# Altium schematic sheet Motor Driver_2.SchDoc
size A4; Organization: ORGANIZATION; Address1: ADDRESS 1; Address2: ADDRESS 2; Address3: ADDRESS 3; Address4: ADDRESS 4; Revision: -; SheetNumber: 9; SheetTotal: 11; ENG_APP_DATE: --/--/--; DSN_APP_DATE: --/--/--; CHK_APP_DATE: --/--/--
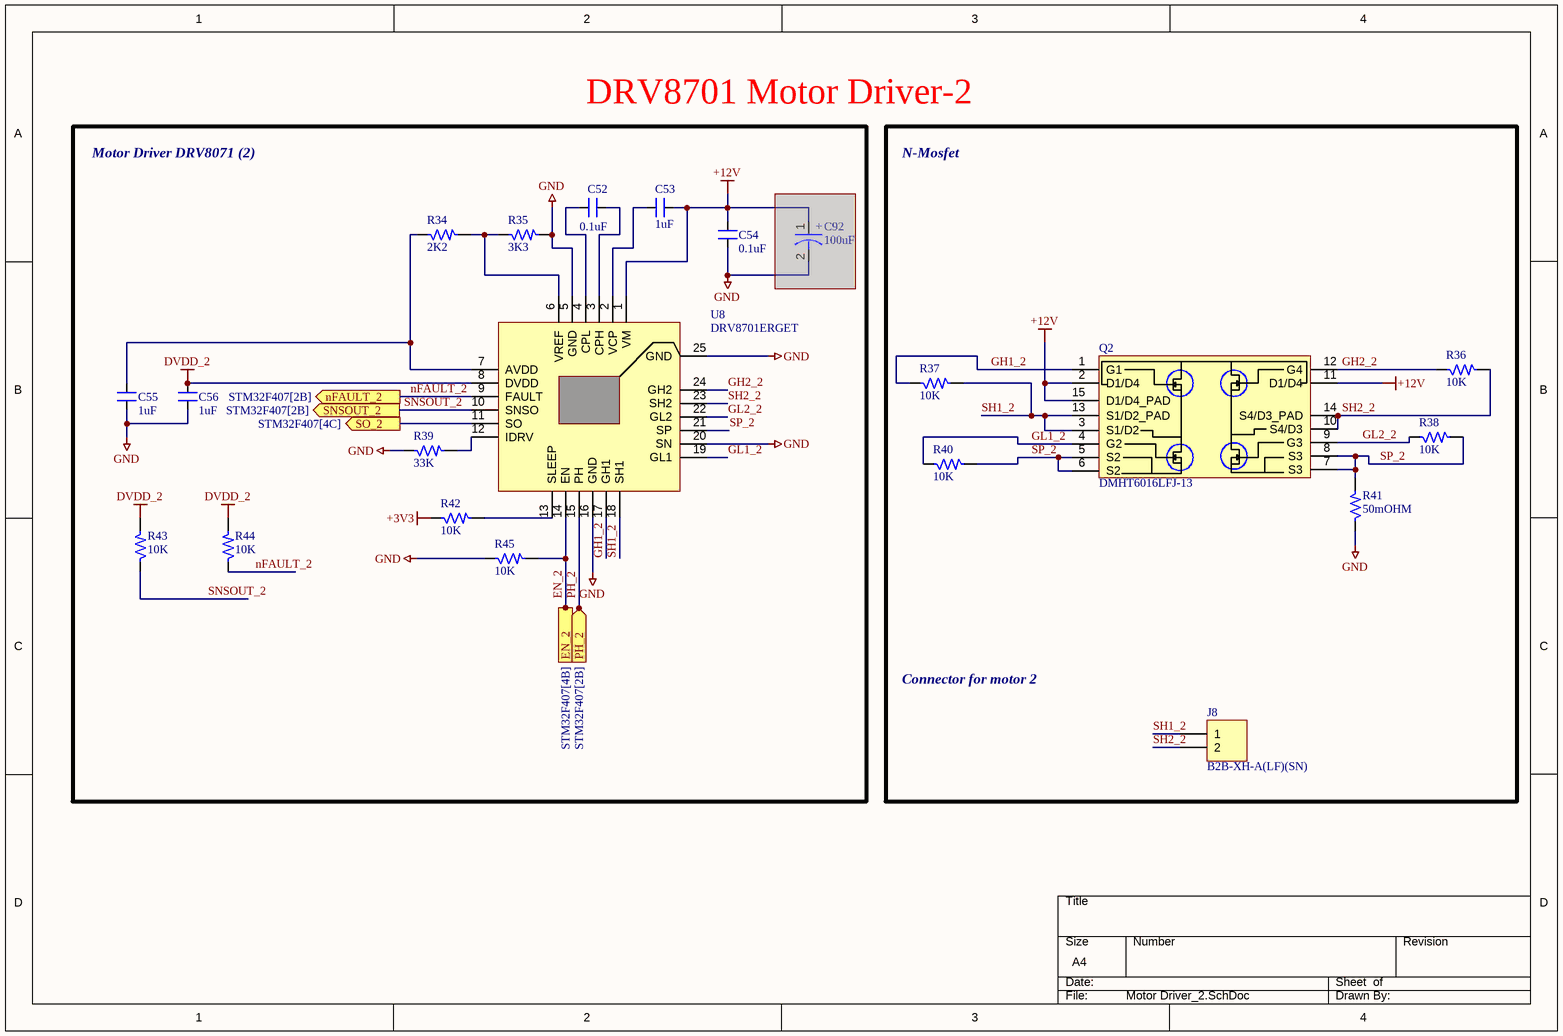
[diagram p0: Motor Driver_2.SchDoc]

## Parts
C52  0.1uF  [CAP_0805]
C53  1uF  [CAP_0805]
C54  0.1uF  [CAP_0805]
C55  1uF  [CAP_0805]
C56  1uF  [CAP_0805]
C92  100uF  [ACAP_P305_D393_H393_RAD]  (masked out: inside a compile mask, not in the netlist)
J8  B2B-XH-A(LF)(SN)  [CON2_100_B2B-XH-A_TH_ST]
Q2  DMHT6016LFJ-13  [DFN5045-12_33_212_27X15_SMD_1]
R34  2K2  [RES_0603]
R35  3K3  [RES_0603]
R36  10K  [RES_0603]
R37  10K  [RES_0603]
R38  10K  [RES_0603]
R39  33K  [RES_0805]
R40  10K  [RES_0603]
R41  50mOHM  [RES_2512]
R42  10K  [RES_0603]
R43  10K  [RES_0603]
R44  10K  [RES_0603]
R45  10K  [RES_0603]
U8  DRV8701ERGET  [VFQFN24_19.6_196_12X32_SMD_1]

## Blocks framed on the sheet
DRV8701 Motor Driver-2: C52-C56 C92 R34 R35 R39 R42-R45 U8

## Ports
EN_2 (in, see STM32F407[4B]), nFAULT_2 (out, see STM32F407[2B]), PH_2 (in, see STM32F407[2B]), SNSOUT_2 (out, see STM32F407[2B]), SO_2 (out, see STM32F407[4C])

## Nets
+3V3: R42.1
+12V: C53.2 C54.2 Q2.2(D1/D4) Q2.11(D1/D4) Q2.15(D1/D4_PAD) U8.1(VM)
DVDD_2: C56.2 R43.2 R44.2 U8.8(DVDD)
GND: C54.1 C55.1 C56.1 R35.2 R39.1 R41.1 R45.1 U8.5(GND) U8.16(GND) U8.20(SN) U8.25(GND)
EN_2: R45.2 U8.14(EN) ; port EN_2
GH1_2: Q2.1(G1) R37.1 U8.17(GH1)
GH2_2: Q2.12(G4) R36.1 U8.24(GH2)
GL1_2: Q2.4(G2) R40.1 U8.19(GL1)
GL2_2: Q2.9(G3) R38.1 U8.22(GL2)
nFAULT_2: R44.1 U8.9(FAULT) ; port nFAULT_2
PH_2: U8.15(PH) ; port PH_2
SH1_2: J8.1 Q2.3(S1/D2) Q2.13(S1/D2_PAD) R37.2 U8.18(SH1)
SH2_2: J8.2 Q2.10(S4/D3) Q2.14(S4/D3_PAD) R36.2 U8.23(SH2)
SNSOUT_2: R43.1 U8.10(SNSO) ; port SNSOUT_2
SO_2: U8.11(SO) ; port SO_2
SP_2: Q2.5(S2) Q2.6(S2) Q2.7(S3) Q2.8(S3) R38.2 R40.2 R41.2 U8.21(SP)
NetC52_1: C52.1 U8.3(CPH)
NetC52_2: C52.2 U8.4(CPL)
NetC53_1: C53.1 U8.2(VCP)
NetC55_2: C55.2 R34.1 U8.7(AVDD)
NetR34_2: R34.2 R35.1 U8.6(VREF)
NetR39_2: R39.2 U8.12(IDRV)
NetR42_2: R42.2 U8.13(SLEEP)

## Notes on the sheet
- Motor Driver DRV8071 (2)
- N-Mosfet
- Connector for motor 2
- DWG. NO.
- REV.
- SHT.
- THIS DOCUMENT AND THE DATA DISCLOSED HEREIN OR HEREWITH IS THE PROPERTY OF ALTIUM LIMITED AND MAY BE FREELY DISTRIBUTED IN WHOLE. NO RIGHTS ARE RESERVED OR EXPRESS OR IMPLIED WARANTEE GIVEN.
- REVISION
- DESCRIPTION
- DATE
- APPROVED
- ENG:
- APPROVALS
- PROJECT
- DSN:
- CHK:
- REFERENCE DOCUMENTS
- PROJECT REVISION:
- TITLE
- DOCUMENT REVISION:
- DESIGN ITEM:
- BOM:
- FAB DWG:
- PCB DWG:
- ASSY DWG:
- SCALE:
- SIZE
- B
- CAGE CODE
- FILE NAME
- DWG NO.
- SHEET
- OF
- REV
- (in symbol CAP-P_100uF-50V-20%-RAD) +

## Library data of the parts
C52 C54 = CAP_0.1uF-50V-5%-0805: 0.1µF ±5% 50V Ceramic Capacitor X7R 0805 (2012 Metric); Manufacturer: AVX Corporation; Manufacturer Part Number: 08055C104JAT4A; Alternate Part Number-1: 0805B104M500; Case/Package: 0805; Supplier-1: SIRICOM; Supplier Part Number-1: 0805B104J500CT
C53 C55 C56 = CAP_1uF-50V-5%-0805: 1µF ±5% 50V Ceramic Capacitor X7R 0805 (2012 Metric); Manufacturer: Samsung; Manufacturer Part Number: CC0805JKX7R9BB105; Alternate Part Number-1: 0805F105M500NT; Case/Package: 0805; Supplier-1: SIRICOM; Supplier Part Number-1: CL21B105KBFNNNE
C92 = CAP-P_100uF-50V-20%-RAD: 100µF 50V Aluminum Polymer Capacitor Radial, Can - SMD 28mOhm 4000 Hrs @ 125°C; Manufacturer: Nichicon; Manufacturer Part Number: GYA1H101MCQ1GS; Alternate Part Number-1: VEU101M1HTR-1010; Case/Package: Radial-SMD; Supplier-1: SP ROAD; Supplier Part Number-1: GYA1H101MCQ1GS
J8 = CON-PLG_2X1-100-ST-TH: 2 Pins, 1 Row 2.54mm Pitch, Straight Connector, male; Manufacturer: JST; Mating Part Number: XHP-2; Crimp Part Number: ASXHSXH22K51; Alternate Part Number-1: NA; Manufacturer Part Number: B2B-XH-A(LF)(SN); Case/Package: TH-CON; Supplier-1: SP ROAD; Supplier Part Number-1: B2B-XH-A(LF)(SN)
Q2 = MOSFET-N_60V-14.8A-V-DFN5045-12: Mosfet Array 4 N-Channel 14.8A (Ta) Surface Mount V-DFN5045-12; Manufacturer: ON Semiconductor; Alternate Part Number-1: DMHT3006LFJ-13; Manufacturer Part Number: DMHT6016LFJ-13; Case/Package: DFN5045-12; Supplier-1: LCSC; Supplier Part Number-1: C460986
R34 = RES_2K2-0.1W-5%-0603: 2.2 kOhms ±5% 0.1W, 1/10W Chip Resistor 0603 (1608 Metric) Automotive AEC-Q200 Thick Film; Manufacturer: Stackpole Electronics; Manufacturer Part Number: ERJ-3GEYJ222V; Alternate Part Number-1: WR06X2201FTL; Case/Package: 0603; Supplier-1: SIRICOM; Supplier Part Number-1: WR06X2201FTL
R35 = RES_3.3K-0.1W-1%-0603: 3.3 kOhms ±1% 0.1W, 1/10W Chip Resistor 0603 (1608 Metric) Automotive AEC-Q200 Thick Film; Manufacturer: Wilson; Manufacturer Part Number: WR06X3301FTL; Alternate Part Number-1: 0603WAF3301T5E; Case/Package: 0603; Supplier-1: SIRICOM; Supplier Part Number-1: WR06X3301FTL
R36-R38 R40 R42-R45 = RES_10K-0.1W-1%-0603: 10 kOhms ±1% 0.1W, 1/10W Chip Resistor 0603 (1608 Metric) Automotive AEC-Q200 Thick Film; Manufacturer: Walsin; Manufacturer Part Number: WR06X1002FTL; Alternate Part Number-1: 0603WAJ0103T5E; Case/Package: 0603; Supplier-1: SIRICOM; Supplier Part Number-1: WR06X1002FTL
R39 = RES_33K-0.125W-1%-0805: Thick Film Resistors - SMD 33KOhms 1/8W 150V33 kOhms ±1% 0.125W, 1/8W Chip Resistor 0805 (2012 Metric) Thick Film; Manufacturer: Vishay BCcomponents; Manufacturer Part Number: CRG0805F33K; Alternate Part Number-1: NA; Case/Package: 0805; Supplier-1: SIRICOM; Supplier Part Number-1: WR08X3302FTL
R41 = RES_50mOhm-2W-1%-2512: 50 mOhms ±1% 2W Chip Resistor 2512 (6432 Metric) Automotive AEC-Q200, Current Sense, Moisture Resistant Metal Element; Manufacturer: Yageo; Manufacturer Part Number: PA2512FKF7W0R05E; Alternate Part Number-1: PMR100HZPFU5L00; Case/Package: 2512; Supplier-1: SIRICOM; Supplier Part Number-1: LR2512-22R060F1
U8 = IC_DRV8701ERGET: Motor Driver Power MOSFET Parallel 24-VQFN (4x4); Manufacturer: Texas Instruments; Alternate Part Number-1: NA; Manufacturer Part Number: DRV8701ERGET; Case/Package: VFQFN24; Supplier-1: ARROW; Supplier Part Number-1: DRV8701ERGET